# Altium schematic sheet Power.SchDoc: Power System
size A4; ApprovedBy: Self; CheckedBy: Self; CompanyName: TAISAT; DrawnBy: Alperen FENERCİ; Organization: IKA; SheetNumber: 6; SheetTotal: 6
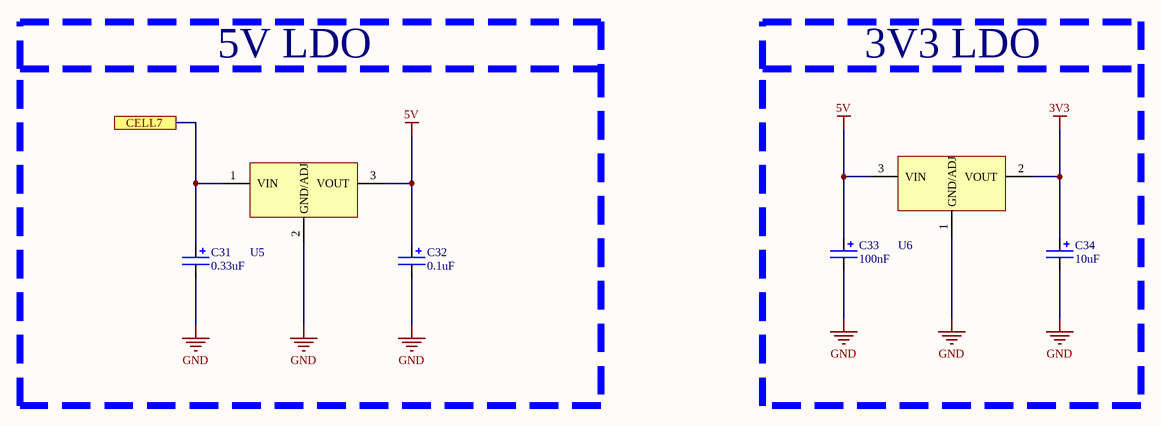
[diagram p0: Power.SchDoc]

## Parts
C31  value 0.33uF  [CAP 0603]  (hidden comment: CAP 0603)
C32  value 0.1uF  [CAP 0603]  (hidden comment: CAP 0603)
C33  value 100nF  [CAP 0603]  (hidden comment: CAP 0603)
C34  value 10uF  [CAP 0603]  (hidden comment: CAP 0603)
U5  LM7805MPX  [SOT223-3]  (value not drawn)
U6  LD1117AS33  [SOT223-3]  (value not drawn)

## Blocks framed on the sheet
5V LDO: C31 C32 U5
3V3 LDO: C33 C34 U6

## Ports
CELL7

## Nets
3V3: C34.1 U6.2(VOUT)
5V: C32.1 C33.1 U5.3(VOUT) U6.3(VIN)
GND: C31.2 C32.2 C33.2 C34.2 U5.2(GND/ADJ) U6.1(GND/ADJ)
CELL7: C31.1 U5.1(VIN) ; port CELL7

## Notes on the sheet
- Dosya Adı / File Name
- Proje Adı / Project Name
- Sayfa Adı / Sheet Name
- Şirket Adı / Company Name
- Tasarlayan / Designed By
- Takım / Team
- Kontrol Eden / Checked By
- Başlangıç Tarihi / Start Date
- Revize Tarihi / Revision Date
- Onaylayan / Approved By
- Sayfa / Sheet

## Library data of the parts
C31-C34 = CAP 0603: Multilayer Ceramic Capacitor; Capacitor Type: MLCC; Case/Package: 0603
U5 = LM7805MPX: Regulator Linear
U6 = LD1117AS33: Regulator Linear; Case/Package: SOT223; ComponentLink1Description: Ozdisan; ComponentLink1URL: *; ComponentLink2Description: Datasheet; ComponentLink2URL: *; Category: Linear Regulator